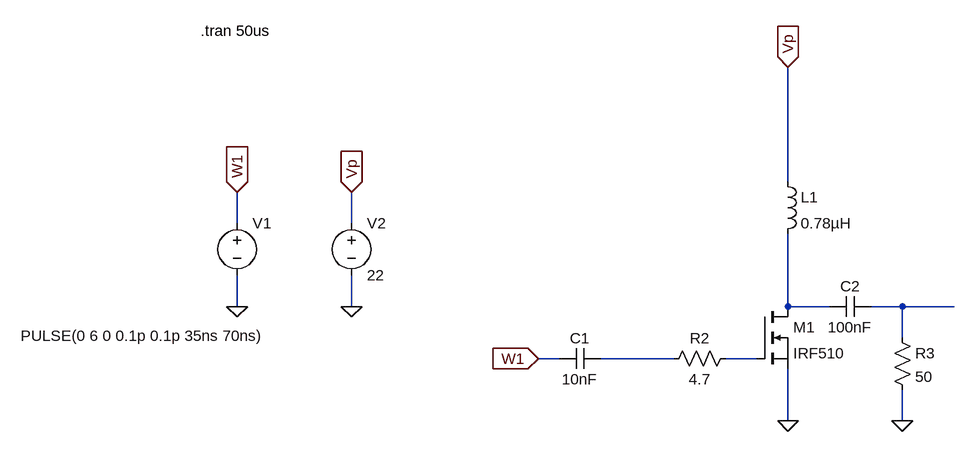
[diagram p0: schematic Miro-Circuit-Almost.asc]
Miro-Circuit-Almost.asc, the LTspice schematic file:
Version 4
SHEET 1 1044 680
WIRE 496 -208 496 -384
WIRE -352 -144 -352 -192
WIRE -176 -144 -176 -192
WIRE -352 -16 -352 -64
WIRE -176 -16 -176 -64
WIRE 496 -16 496 -128
WIRE 560 -16 496 -16
WIRE 672 -16 624 -16
WIRE 752 -16 672 -16
WIRE 496 0 496 -16
WIRE 672 32 672 -16
WIRE 144 64 112 64
WIRE 320 64 208 64
WIRE 448 64 400 64
WIRE 496 160 496 80
WIRE 672 160 672 112
FLAG 112 64 W1
IOPIN 112 64 In
FLAG 496 -384 Vp
IOPIN 496 -384 In
FLAG -352 -16 0
FLAG -176 -16 0
FLAG -352 -192 W1
IOPIN -352 -192 In
FLAG -176 -192 Vp
IOPIN -176 -192 In
FLAG 496 160 0
FLAG 672 160 0
SYMBOL voltage -352 -160 R0
WINDOW 3 -333 189 Left 2
WINDOW 123 0 0 Left 0
WINDOW 39 0 0 Left 0
SYMATTR Value PULSE(0 6 0 0.1p 0.1p 35ns 70ns)
SYMATTR InstName V1
SYMBOL voltage -176 -160 R0
WINDOW 123 0 0 Left 0
WINDOW 39 0 0 Left 0
SYMATTR InstName V2
SYMATTR Value 22
SYMBOL cap 208 48 R90
WINDOW 0 0 32 VBottom 2
WINDOW 3 32 32 VTop 2
SYMATTR InstName C1
SYMATTR Value 10nF
SYMBOL ind 480 -224 R0
SYMATTR InstName L1
SYMATTR Value 0.78µH
SYMBOL res 656 16 R0
SYMATTR InstName R3
SYMATTR Value 50
SYMBOL res 416 48 R90
WINDOW 0 0 56 VBottom 2
WINDOW 3 32 56 VTop 2
SYMATTR InstName R2
SYMATTR Value 4.7
SYMBOL cap 624 -32 R90
WINDOW 0 0 32 VBottom 2
WINDOW 3 32 32 VTop 2
SYMATTR InstName C2
SYMATTR Value 100nF
SYMBOL nmos 448 -16 R0
SYMATTR InstName M1
SYMATTR Value IRF510
TEXT -408 -440 Left 2 !.tran 50us

The netlist it stands for:
* Miro-Circuit-Almost.asc
V1 W1 0 PULSE(0 6 0 0.1p 0.1p 35ns 70ns)
V2 Vp 0 22
C1 N003 W1 10nF
L1 Vp N001 0.78µH
R3 N002 0 50
R2 N004 N003 4.7
C2 N002 N001 100nF
M1 N001 N004 0 0 IRF510
.model NMOS NMOS
.model PMOS PMOS
.lib standard.mos
.tran 50us
.backanno
.end